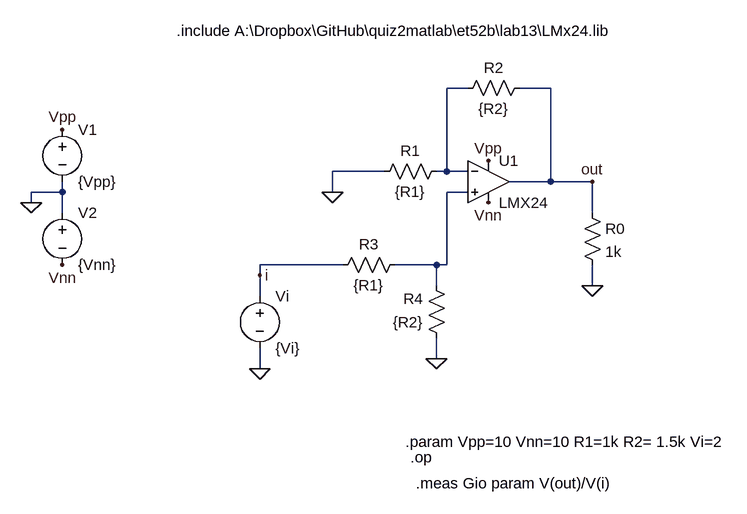
[diagram p0: schematic lab13c.asc]
lab13c.asc, the LTspice schematic file:
Version 4
SHEET 1 988 680
WIRE -16 32 -48 32
WIRE 112 32 64 32
WIRE -144 160 -224 160
WIRE -48 160 -48 32
WIRE -48 160 -64 160
WIRE -16 160 -48 160
WIRE 112 176 112 32
WIRE 112 176 48 176
WIRE 176 176 112 176
WIRE -640 192 -640 176
WIRE -640 192 -688 192
WIRE -224 192 -224 160
WIRE -16 192 -48 192
WIRE -688 208 -688 192
WIRE -640 224 -640 192
WIRE 176 224 176 176
WIRE -208 304 -336 304
WIRE -64 304 -128 304
WIRE -48 304 -48 192
WIRE -48 304 -64 304
WIRE -336 320 -336 304
WIRE -64 336 -64 304
WIRE 176 336 176 304
WIRE -336 352 -336 320
WIRE -64 448 -64 416
WIRE -336 464 -336 432
FLAG 16 144 Vpp
FLAG 16 208 Vnn
FLAG -688 208 0
FLAG -640 96 Vpp
FLAG -640 304 Vnn
FLAG -336 464 0
FLAG 176 176 out
FLAG 176 336 0
FLAG -336 320 i
FLAG -224 192 0
FLAG -64 448 0
SYMBOL Opamps\\opamp2 16 112 R0
SYMATTR InstName U1
SYMATTR Value LMX24
SYMBOL voltage -640 80 R0
SYMATTR InstName V1
SYMATTR Value {Vpp}
SYMBOL voltage -640 208 R0
SYMATTR InstName V2
SYMATTR Value {Vnn}
SYMBOL voltage -336 336 R0
SYMATTR InstName Vi
SYMATTR Value {Vi}
SYMBOL res 160 208 R0
SYMATTR InstName R0
SYMATTR Value 1k
SYMBOL res -48 144 R90
WINDOW 0 0 56 VBottom 2
WINDOW 3 32 56 VTop 2
SYMATTR InstName R1
SYMATTR Value {R1}
SYMBOL res 80 16 R90
WINDOW 0 0 56 VBottom 2
WINDOW 3 32 56 VTop 2
SYMATTR InstName R2
SYMATTR Value {R2}
SYMBOL res -112 288 R90
WINDOW 0 0 56 VBottom 2
WINDOW 3 32 56 VTop 2
SYMATTR InstName R3
SYMATTR Value {R1}
SYMBOL res -48 432 R180
WINDOW 0 36 76 Left 2
WINDOW 3 36 40 Left 2
SYMATTR InstName R4
SYMATTR Value {R2}
TEXT -464 -56 Left 2 !.include A:\\Dropbox\\GitHub\\quiz2matlab\\et52b\\lab13\\LMx24.lib
TEXT -112 576 Left 2 !.param Vpp=10 Vnn=10 R1=1k R2= 1.5k Vi=2
TEXT -104 600 Left 2 !.op
TEXT -96 640 Left 2 !.meas Gio param V(out)/V(i)

The netlist it stands for:
* lab13c.asc
XU1 N002 N001 Vpp Vnn out LMX24  ; pins In+ In- V+ V- OUT
V1 Vpp 0 {Vpp}
V2 0 Vnn {Vnn}
Vi i 0 {Vi}
R0 out 0 1k
R1 N001 0 {R1}
R2 out N001 {R2}
R3 N002 i {R1}
R4 0 N002 {R2}
.include A:\Dropbox\GitHub\quiz2matlab\et52b\lab13\LMx24.lib
.param Vpp=10 Vnn=10 R1=1k R2= 1.5k Vi=2
.op
.meas Gio param V(out)/V(i)
.backanno
.end